# EAGLE design lora_mini_uno (EAGLE 8.2.2)

## Sheet 1 of 2
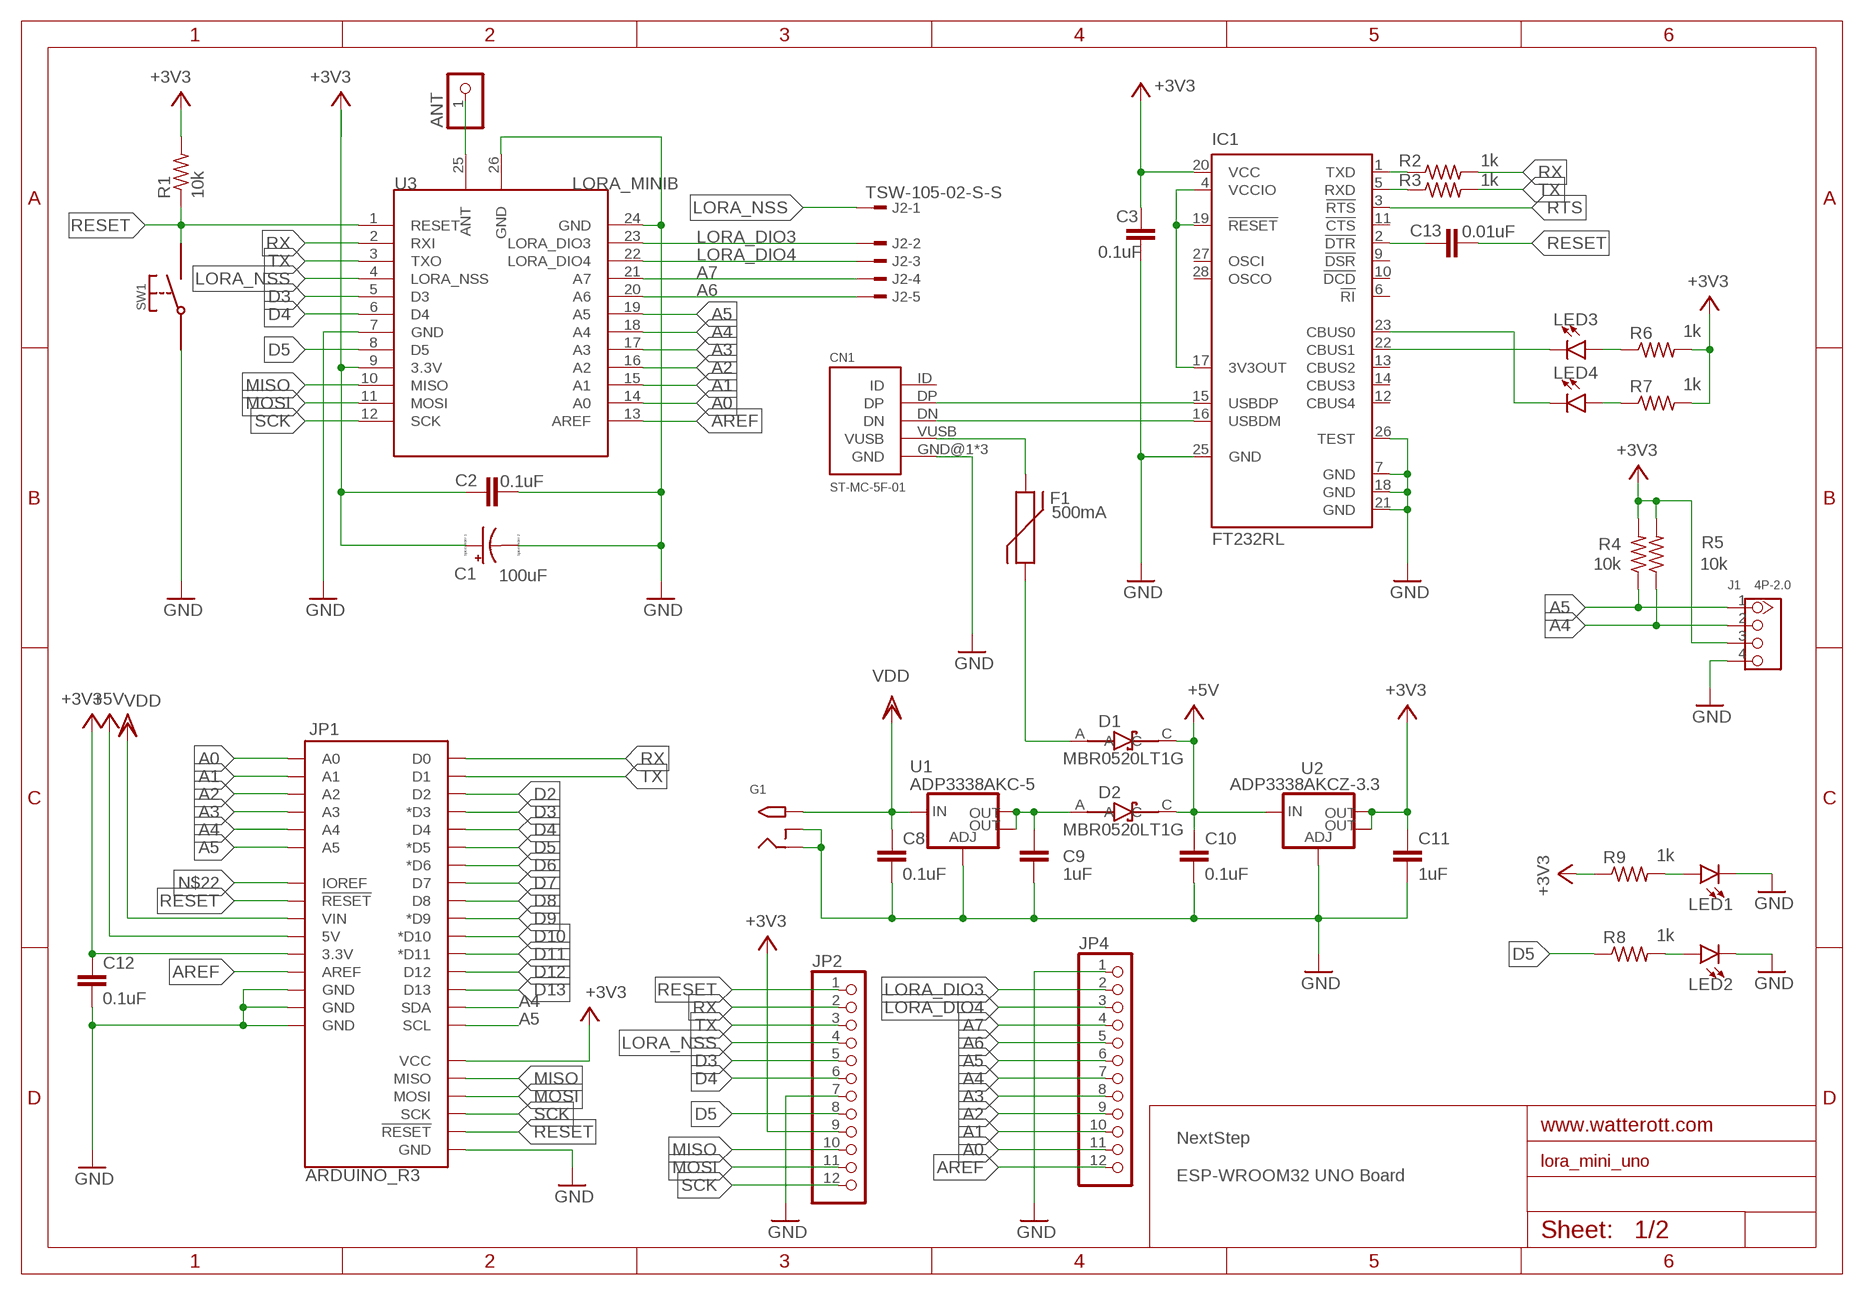
[diagram p0: schematic, sheet 1]

### Parts
ANT  PINHD-1X1  [1X01]
C1  100uF  CPOL-US153CLV-0505  [153CLV-0505]
C2  0.1uF  C-EUC0603K  [C0603K]
C3  0.1uF  C-EUC0603K  [C0603K]
C8  0.1uF  C-EUC0603K  [C0603K]
C9  1uF  C-EUC0603K  [C0603K]
C10  0.1uF  C-EUC0603K  [C0603K]
C11  1uF  C-EUC0603K  [C0603K]
C12  0.1uF  C-EUC0603K  [C0603K]
C13  0.01uF  C-EUC0603K  [C0603K]
CN1  ST-MC-5F-01  [ST-MC-5F-01]
D1  MBR0520LT1G  [SOD3716X135N]
D2  MBR0520LT1G  [SOD3716X135N]
F1  500mA  FUSE1206  [R1206]
G1  2.1MMJACKTHM  [PJ-102A]
IC1  FT232RL  [SSOP28]
J1  4P-2.0  GROVE-CONNECTOR-DIP(4P-2.0)  [HW4-2.0]
J2  TSW-105-02-S-S  [TSW-105-02-S-S]
JP1  ARDUINO_R3  [ARDUINO_R3]
JP2  PINHD-1X12-CB  [1X12-CB]
JP4  PINHD-1X12-CB  [1X12-CB]
LED1  LED0603  [LED-0603]
LED2  LED0603  [LED-0603]
LED3  LED0603  [LED-0603]
LED4  LED0603  [LED-0603]
R1  10k  R-US_R0603  [R0603]
R2  1k  R-US_R0603  [R0603]
R3  1k  R-US_R0603  [R0603]
R4  10k  R-US_R0603  [R0603]
R5  10k  R-US_R0603  [R0603]
R6  1k  R-US_R0603  [R0603]
R7  1k  R-US_R0603  [R0603]
R8  1k  R-US_R0603  [R0603]
R9  1k  R-US_R0603  [R0603]
SW1  RESET  SWITCH  [SWITCH_3X6X5MM]
U1  ADP3338AKC-5  V_REG_LM1117SOT223  [SOT223]
U2  ADP3338AKCZ-3.3  V_REG_LM1117SOT223  [SOT223]
U3  LORA_MINIB  [LORA_MINI_PCB]

### Nets
+3V3 [Power]: C1.+ C2.1 C3.1 C11.1 C12.1 IC1.20(VCC) J1.3 JP1.3.3V JP1.VCC JP2.9 R1.2 R4.2 R5.2 R6.2 R7.2 R9.1 U2.2(OUT) U2.4(OUT) U3.9(3.3V) ; also sheet 2
+5V [Power]: C10.1 D1.C D2.C JP1.5V U2.3(IN)
A0: JP1.A0 JP4.11 U3.14(A0)
A1: JP1.A1 JP4.10 U3.15(A1)
A2: JP1.A2 JP4.9 U3.16(A2)
A3: JP1.A3 JP4.8 U3.17(A3)
A4: J1.2 JP1.A4 JP1.SDA JP4.7 R5.1 U3.18(A4) ; also sheet 2
A5: J1.1 JP1.A5 JP1.SCL JP4.6 R4.1 U3.19(A5) ; also sheet 2
A6: J2.5 JP4.5 U3.20(A6)
A7: J2.4 JP4.4 U3.21(A7)
AREF: JP1.AREF JP4.12 U3.13(AREF)
D2: JP1.D2
D3: JP1.D3(*D3) JP2.5 U3.5(D3)
D4: JP1.D4 JP2.6 U3.6(D4)
D5: JP1.D5(*D5) JP2.8 R8.1 U3.8(D5)
D6: JP1.D6(*D6)
D7: JP1.D7
D8: JP1.D8
D9: JP1.D9(*D9)
D10: JP1.D10(*D10)
D11: JP1.D11(*D11)
D12: JP1.D12
D13: JP1.D13
D+: CN1.DP IC1.15(USBDP)
D-: CN1.DN IC1.16(USBDM)
GND [GND]: C1.- C2.2 C3.2 C8.2 C9.2 C10.2 C11.2 C12.2 CN1.GND@1(GND) CN1.GND@2(GND) CN1.GND@3(GND) G1.RING G1.RING_SW IC1.7(GND) IC1.18(GND) IC1.21(GND) IC1.25(GND) IC1.26(TEST) J1.4 JP1.GND@1(GND) JP1.GND@2(GND) JP1.GND@3(GND) JP1.GND@4(GND) JP2.7 JP4.1 LED1.C LED2.C SW1.P$1 U1.1(ADJ) U2.1(ADJ) U3.7(GND) U3.24(GND) U3.26(GND) ; also sheet 2
LORA_DIO3: J2.2 JP4.2 U3.23(LORA_DIO3)
LORA_DIO4: J2.3 JP4.3 U3.22(LORA_DIO4)
LORA_NSS: J2.1 JP2.4 U3.4(LORA_NSS)
MISO: JP1.MISO JP2.10 U3.10(MISO)
MOSI: JP1.MOSI JP2.11 U3.11(MOSI)
N$2: IC1.22(CBUS1) LED3.C
N$3: IC1.23(CBUS0) LED4.C
N$5 [Power]: CN1.VUSB F1.2
N$6: IC1.1(TXD) R2.1
N$7: IC1.4(VCCIO) IC1.17(3V3OUT) IC1.19(!RESET)
N$9: C13.1 IC1.2(!DTR)
N$10: IC1.5(RXD) R3.1
N$11: ANT.1 U3.25(ANT)
N$12: LED2.A R8.2
N$13 [Power]: C9.1 D2.A U1.2(OUT) U1.4(OUT)
N$14 [Power]: D1.A F1.1
N$22: JP1.IOREF
PWR-LED: LED1.A R9.2
RESET: C13.2 JP1.RESET@1(!RESET!) JP1.RESET@2(!RESET!) JP2.1 R1.1 SW1.P$2 U3.1(RESET)
RTS: IC1.3(!RTS)
RX: JP1.D0 JP2.2 R2.2 U3.2(RXI)
RX-LED: LED3.A R6.1
SCK: JP1.SCK JP2.12 U3.12(SCK)
TX: JP1.D1 JP2.3 R3.2 U3.3(TXO)
TX-LED: LED4.A R7.1
VDD [Power]: C8.1 G1.TIP JP1.VIN U1.3(IN)
Unconnected: CN1.ID IC1.6(!RI) IC1.9(!DSR) IC1.10(!DCD) IC1.11(!CTS) IC1.12(CBUS4) IC1.13(CBUS2) IC1.14(CBUS3) IC1.27(OSCI) IC1.28(OSCO)

### Notes on the sheet
- NextStep
  
  ESP-WROOM32 UNO Board

## Sheet 2 of 2
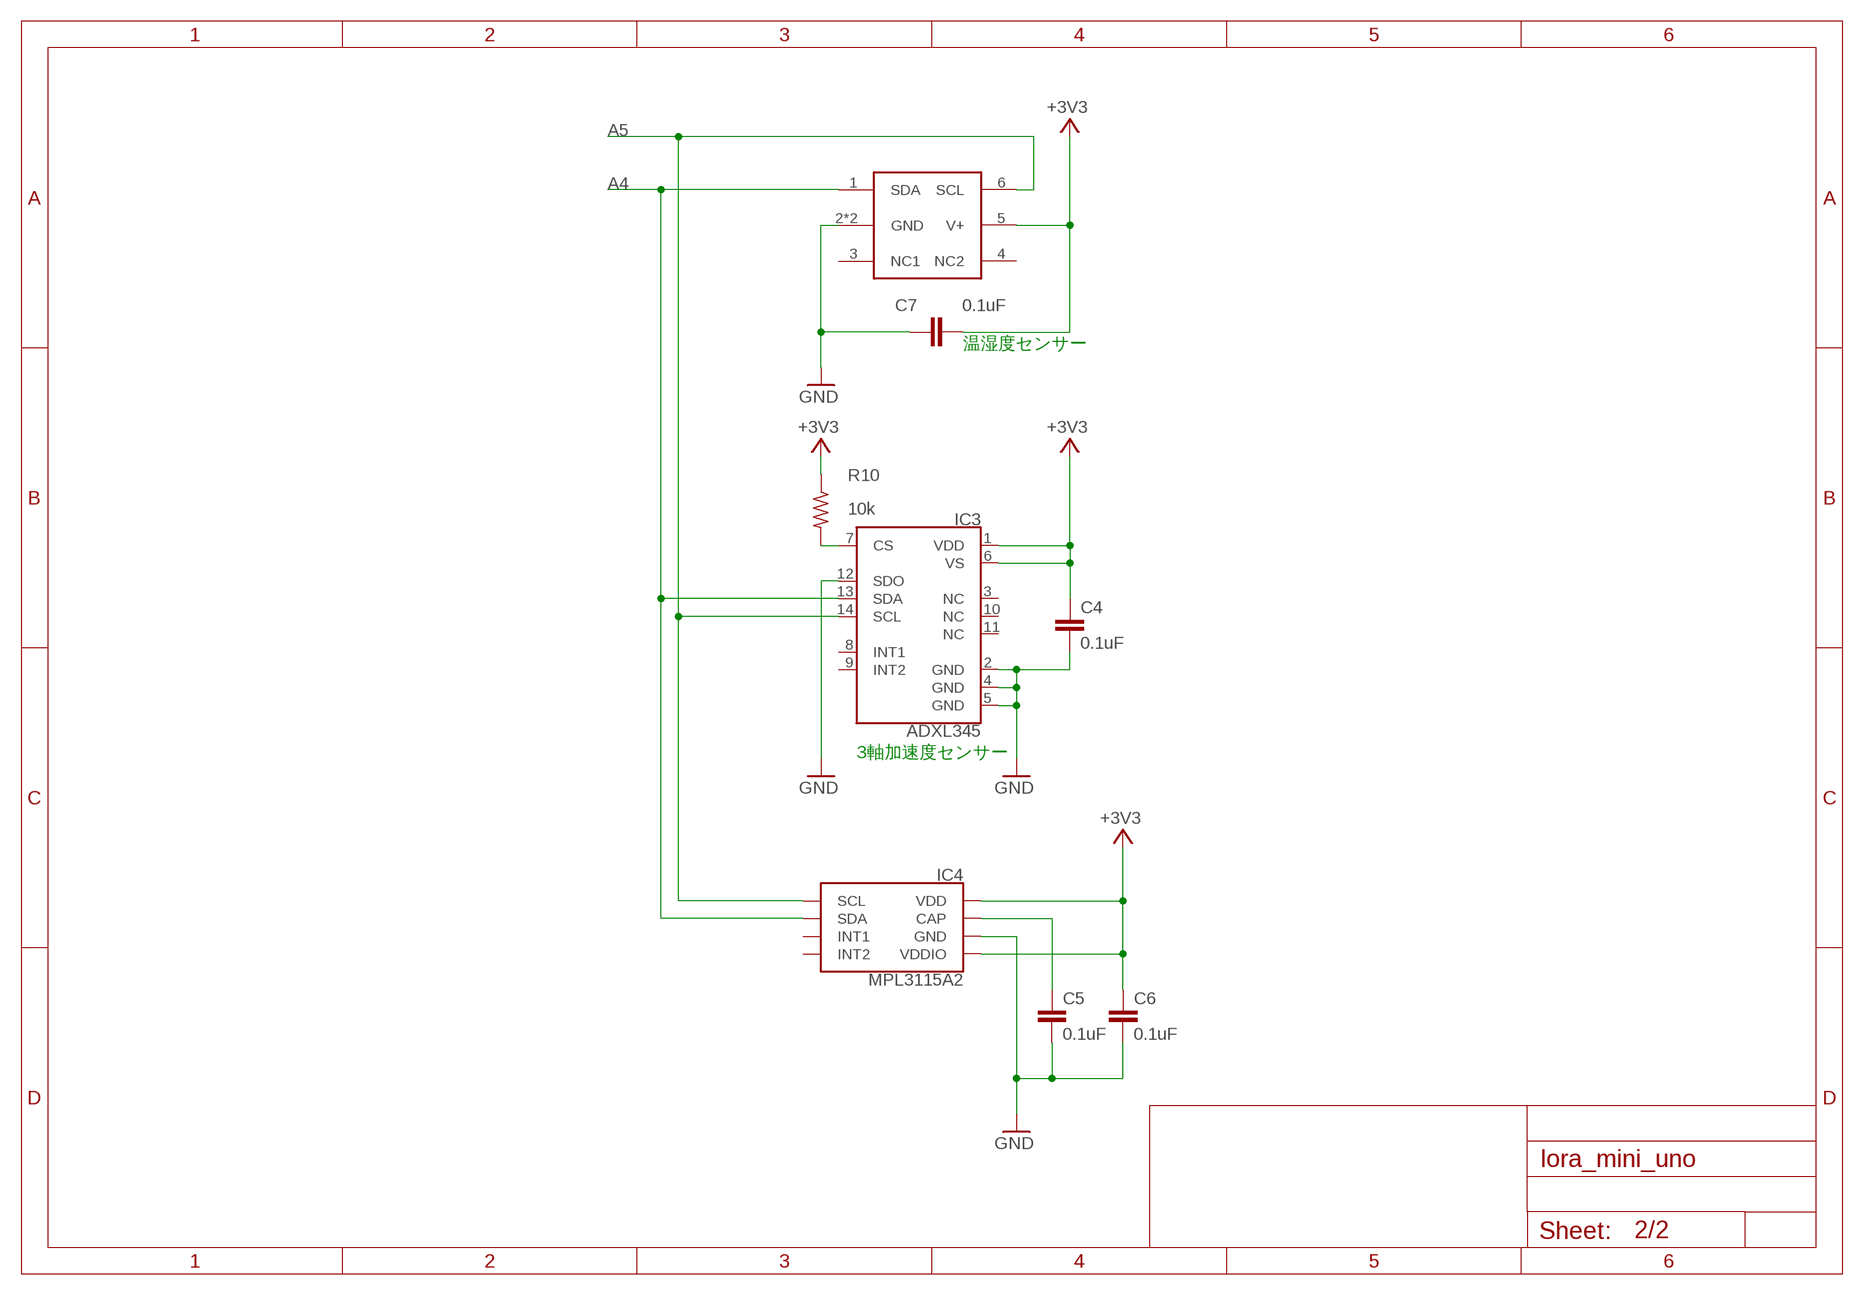
[diagram p1: schematic, sheet 2]

### Parts
C4  0.1uF  C-EUC0603K  [C0603K]
C5  0.1uF  C-EUC0603K  [C0603K]
C6  0.1uF  C-EUC0603K  [C0603K]
C7  0.1uF  C-EUC0603K  [C0603K]
IC2  SHT21  [SHT21]
IC3  ADXL345  [LGA-14]
IC4  MPL3115A2  [LGA-8-5X3]
R10  10k  R-US_R0603  [R0603]

### Nets
+3V3 [Power]: C4.1 C6.1 C7.2 IC2.5(V+) IC3.1(VDD) IC3.6(VS) IC4.1(VDD) IC4.4(VDDIO) R10.1 ; also sheet 1
A4: IC2.1(SDA) IC3.13(SDA) IC4.7(SDA) ; also sheet 1
A5: IC2.6(SCL) IC3.14(SCL) IC4.8(SCL) ; also sheet 1
GND [GND]: C4.2 C5.2 C6.2 C7.1 IC2.2(GND) IC2.P$1(GND) IC3.2(GND) IC3.4(GND) IC3.5(GND) IC3.12(SDO) IC4.3(GND) ; also sheet 1
N$1: IC3.7(CS) R10.2
N$15: C5.1 IC4.2(CAP)
Unconnected: IC2.3(NC1) IC2.4(NC2) IC3.3(NC) IC3.8(INT1) IC3.9(INT2) IC3.10(NC) IC3.11(NC) IC4.5(INT2) IC4.6(INT1)

### Notes on the sheet
- 温湿度センサー
- 3軸加速度センサー

## Library data of the parts
ANT = adafruit:PINHD-1X1: Pin header 1x1 for 0.1" spacing With round pins
C1 = resistor:CPOL-US: POLARIZED CAPACITOR, American symbol
C2-C13 = resistor:C-EU: CAPACITOR, European symbol
CN1 = st-mc-5f-01:ST-MC-5F-01
D1 D2 = MBR0520LT1G:MBR0520LT1G: Rectifier, Schottky Power; Plastic Sod-123; 0.5 a @ +90c If; +125; 20v; 1000; AVAILABILITY: Good; DESCRIPTION: Rectifier, Schottky Power; Plastic Sod-123; 0.5 a @ +90c If; +125; 20v; 1000; MF: ON Semiconductor; MP: MBR0520LT1G; PACKAGE: SOD-123 ON Semiconductor; PRICE: 0.14 USD
F1 = dragino:FUSE: FUSE 5 x 20 mm
G1 = adafruit:2.1MMJACK: 2.1mm x 5.5mm THM DC jack with internal switch. Digikey part #PJ-102A, 4UCON part #05537 2.1mm x 5.5mm SMT DC jack with internal switch. Digikey part #PJ-002A-SMT, 4UCON part #03267 By microbuilder.eu & adafruit.com
IC1 = ftdichip:FT232R: Source: http://www.ftdichip.com/Documents/DataSheets/DS_FT232R_v104.pdf; MPN: FT232RL; OC_FARNELL: 1146032; OC_NEWARK: 91K9918
IC2 = SHT21:SHT21: Tempsensor RS No: 709-8868 MRF No: TMP112AIDRLT
IC3 = SparkFun-Sensors:ADXL345: Analog Devices ADXL345 3-Axis SPI/I2C 2/4/8/16g Accelerometer The ADXL345 is a small, thin, low power, 3-axis accelerometer with high resolution (13-bit) measurement at up to ±16g. Digital output data is formatted as 16-bit twos complement and is accessible through either a SPI (3- or 4-wire) or I2C digital interface. Datasheet <https://www.sparkfun.com/datasheets/Sensors/Accelerometer/ADXL345.pdf> SparkFun Products SparkFun Triple Axis Accelerometer Breakout - ADXL345 <https://www.sparkfun.com/products/9836> (SEN-09836) Triple Axis Accelerometer - ADXL345 <https://www.sparkfun.com/products/9045> (SEN-09045) SparkFun 6 Degrees of Freedom IMU Digital Combo Board - ITG3200/ADXL345 <https://www.sparkfun.com/products/10121> (SEN-10121); PROD_ID: IC-09097; SF_ID: SEN-09045
IC4 = SparkFun-Sensors:MPL3115A2: NXP MPL3115A2 Digital Altimeter/Pressure Sensor The MPL3115A2 is a compact piezoresistive absolute pressure sensor with an I2C interface. MPL3115 has a wide operating range of 20kPa to 110 kPa, a range that covers all surface elevations on Earth. The fully internally compensated MEMS in conjunction with an embedded high resolution 24-bit equivalent ADC provide accurate pressure [Pascals] /altitude [meters] and temperature [degrees Celsius] data. Datasheet <http://cdn.sparkfun.com/datasheets/Sensors/Pressure/MPL3115A2.pdf> SparkFun Products SparkFun Altitude/Pressure Sensor Breakout - MPL3115A2 <https://www.sparkfun.com/products/11084> (SEN-11084) SparkFun Weather Shield <https://www.sparkfun.com/products/12081> (DEV-12081) SparkFun Photon Weather Shield <https://www.sparkfun.com/products/13630> (DEV-13630); PROD_ID: IC-10869
J1 = Seeed-OPL-Connector:GROVE-CONNECTOR-DIP(4P-2.0): 320110033
J2 = con-samtec:TSW-105-02-S-S: THROUGH-HOLE .025" SQ POST HEADER Source: Samtec TSW.pdf; OC_FARNELL: unknown; OC_NEWARK: unknown
JP1 = SparkFun-Boards:ARDUINO_R3: Arduino R3 Footprint (w/ SPI header)
JP2 JP4 = adafruit:PINHD-1X12: PIN HEADER
LED1-LED4 = SparkFun-LED:LED: LED (Generic) Standard schematic elements and footprints for 5mm, 3mm, 1206, and 0603 sized LEDs. Generic LEDs with no color specified.
R1-R10 = resistor:R-US_: RESISTOR, American symbol
SW1 = dragino:SWITCH
U1 U2 = SparkFun-PowerIC:V_REG_LM1117: Voltage Regulator LM1117 Standard adjustable voltage regulator but in SMD form. Spark Fun Electronics SKU : COM-00595; PROD_ID: VREG-08170
U3 = dragino:LORA_MINI

## Net classes
0 default: width 0.229 mm
1 Power: width 0.508 mm, clearance 0.152 mm
2 GND: width 0.203 mm

## Board
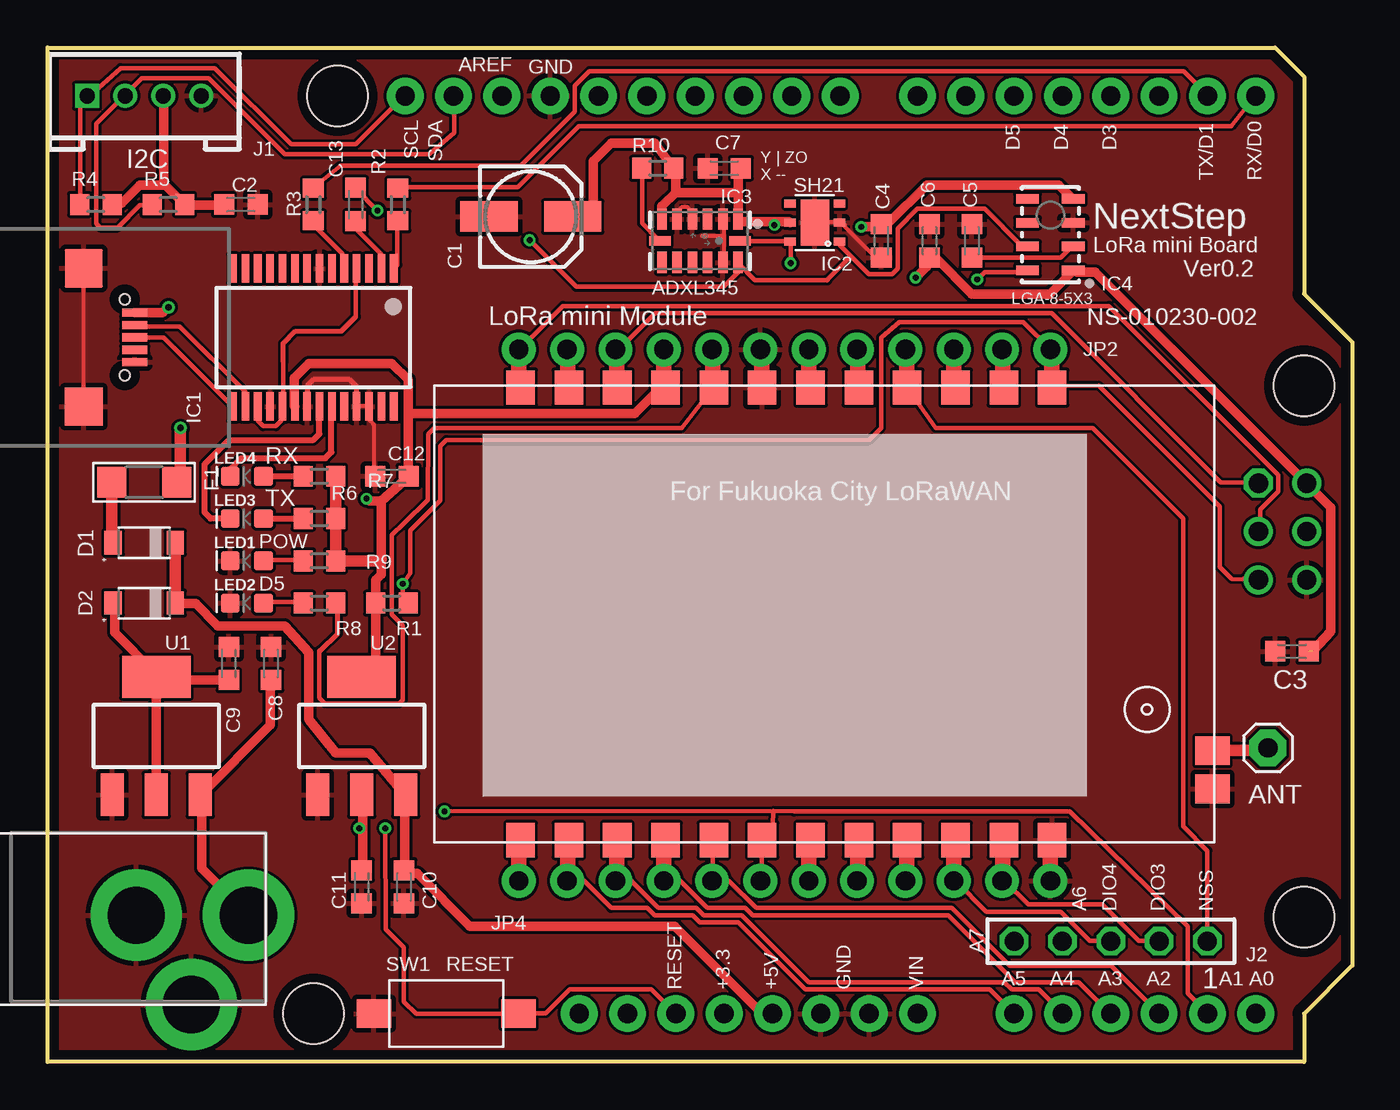
[diagram p2: board, top side]
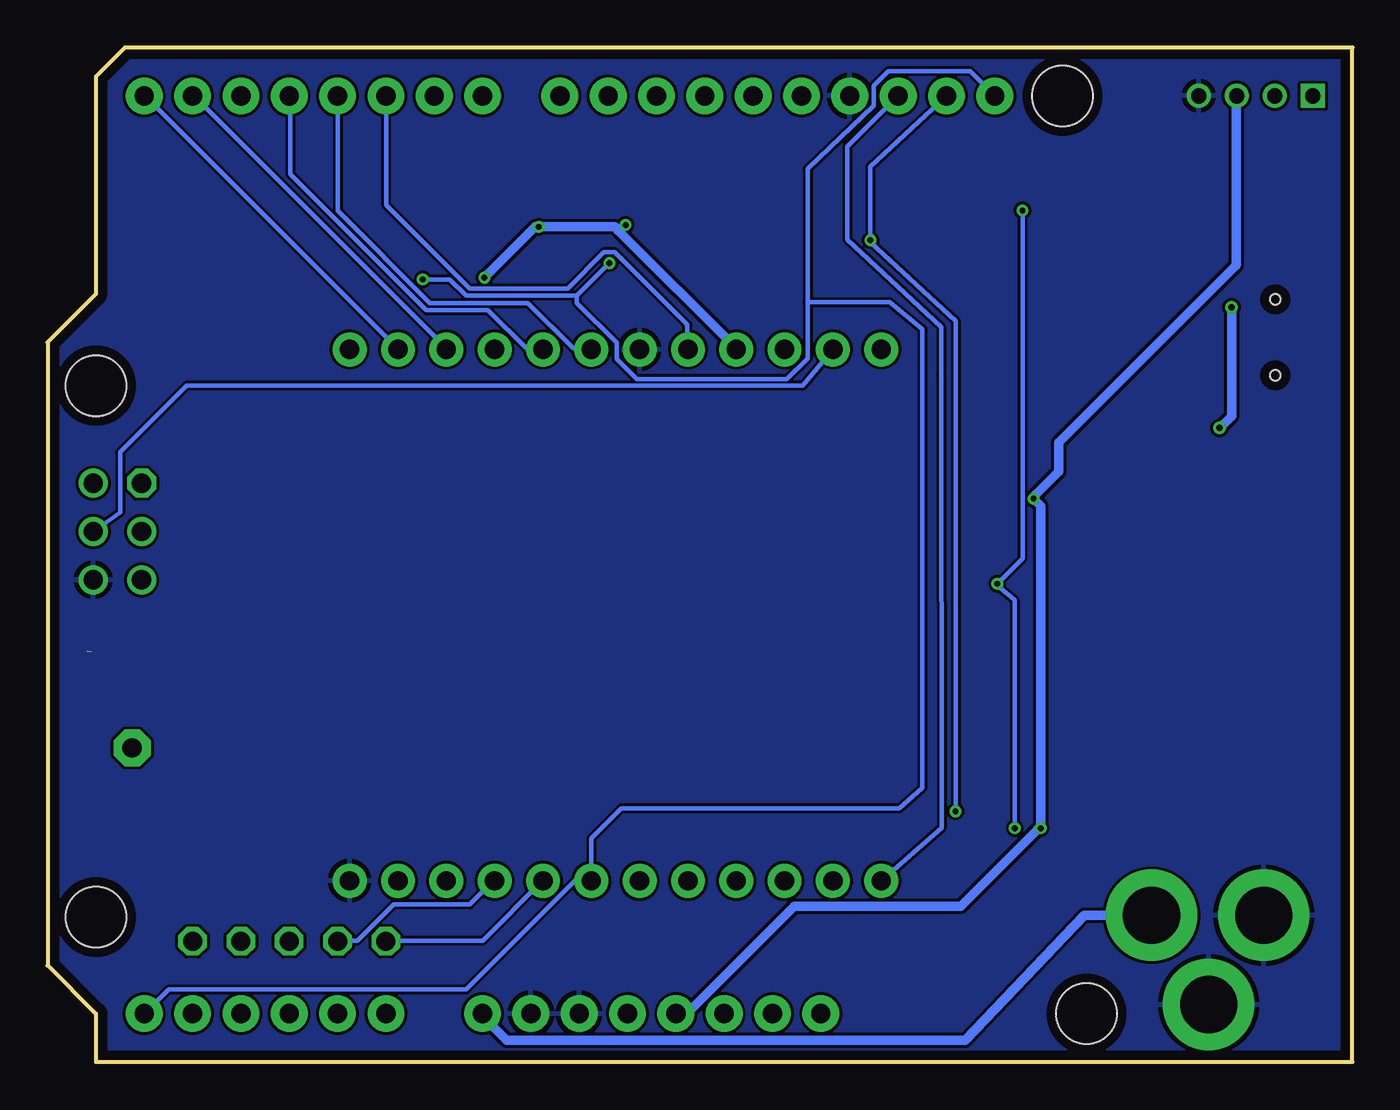
[diagram p3: board, bottom side, seen from below]

Size 68.58 x 53.34 mm. Coordinates in mm from the lower left corner, seen from the top.
Copper layers (1*16): Top 0.035mm / dielectric 1.6mm / Bottom 0.035mm
Design rules "Elecrow_2-layer_PCB_eagle_rule": minimum track width 6mil, minimum drill 12mil, track to track 6mil, track to pad 6mil, pad to pad 6mil, via to via 8mil, smd to smd 0mil, copper to edge 20mil, drill to drill 10mil, minimum pad ring 6mil, minimum via ring 6mil, stop-mask expansion 0mil, vias tented up to drill 100mil, thermal gap 10mil
vRestrict: area 2.2,13 to 9.2,21.6; area 13.3,12.7 to 19.7,21.6; area 31.1,41.3 to 37.5,45.1; area 50.5,40 to 54.9,46.7

### Footprints (pad centres in the part's own frame; a part is rotated, then mirrored left to right if it is on the bottom)
1X01 = drill 1.016 pad 1.93 octagon: 1 0,0
153CLV-0505 = smd 3 x 1.6: + 2.2,0; - -2.2,0
C0603K = smd 1.05 x 1.08: 1 -0.875,0; 2 0.875,0
ST-MC-5F-01 = smd 0.4 x 1.35: DN -0.65,2.675; DP 0,2.675; GND@3 1.3,2.675; ID 0.65,2.675; VUSB -1.3,2.675 | smd 2 x 2: GND@1 -3.63,0; GND@2 3.63,0 | hole 0.55: -2,2.15; 2,2.15
SOD3716X135N = smd 0.91 x 1.22: A 1.635,0; C -1.635,0
R1206 = smd 1.52 x 1.6: 1 -1.71,0; 2 1.71,0
PJ-102A = drill 3 pad 4.8: RING 0.1,-3.39; RING_SW -4.6,-6.29; TIP 0.1,-9.29
SSOP28 = smd 0.4 x 1.5: 1 -4.225,-3.625; 2 -3.575,-3.625; 3 -2.925,-3.625; 4 -2.275,-3.625; 5 -1.625,-3.625; 6 -0.975,-3.625; 7 -0.325,-3.625; 8 0.325,-3.625; 9 0.975,-3.625; 10 1.625,-3.625; 11 2.275,-3.625; 12 2.925,-3.625; 13 3.575,-3.625; 14 4.225,-3.625; 15 4.225,3.625; 16 3.575,3.625; 17 2.925,3.625; 18 2.275,3.625; 19 1.625,3.625; 20 0.975,3.625; 21 0.325,3.625; 22 -0.325,3.625; 23 -0.975,3.625; 24 -1.625,3.625; 25 -2.275,3.625; 26 -2.925,3.625; 27 -3.575,3.625; 28 -4.225,3.625
SHT21 = smd 0.4 x 0.6: 1 -1,-1.3; 2 0,-1.3; 3 1,-1.3; 4 1,1.3; 5 0,1.3; 6 -1,1.3 | smd 2.4 x 1.5: P$1 0,0
LGA-14 = smd 0.5 x 1.124: 1 2,1.138; 2 1.2,1.138; 3 0.4,1.138; 4 -0.4,1.138; 5 -1.2,1.138; 6 -2,1.138; 8 -2,-1.13; 9 -1.2,-1.138; 10 -0.4,-1.138; 11 0.4,-1.138; 12 1.2,-1.138; 13 2,-1.138 | smd 1.124 x 0.5: 7 -2.1,0; 14 2.1,0
LGA-8-5X3 = smd 1.2 x 0.5: 1 -1.2,1.875; 2 -1.2,0.625; 3 -1.2,-0.625; 4 -1.2,-1.875; 5 1.2,-1.875; 6 1.2,-0.625; 7 1.2,0.625; 8 1.2,1.875
HW4-2.0 = drill 0.8 pad 1.27 square: 1 -3,0 | drill 0.8 pad 1.27: 2 -1,0; 3 1,0; 4 3,0
TSW-105-02-S-S = drill 1 pad 1.5 octagon: 1 5.08,0; 2 2.54,0; 3 0,0; 4 -2.54,0; 5 -5.08,0
ARDUINO_R3 = drill 1.016 pad 1.93: 3.3V 35.56,2.54; 5V 38.1,2.54; A0 50.8,2.54; A1 53.34,2.54; A2 55.88,2.54; A3 58.42,2.54; A4 60.96,2.54; A5 63.5,2.54; AREF 23.876,50.8; D0 63.5,50.8; D1 60.96,50.8; D2 58.42,50.8; D3 55.88,50.8; D4 53.34,50.8; D5 50.8,50.8; D6 48.26,50.8; D7 45.72,50.8; D8 41.656,50.8; D9 39.116,50.8; D10 36.576,50.8; D11 34.036,50.8; D12 31.496,50.8; D13 28.956,50.8; GND@1 40.64,2.54; GND@2 43.18,2.54; GND@3 26.416,50.8; IOREF 30.48,2.54; NC 27.94,2.54; RESET@1 33.02,2.54; SCL 18.796,50.8; SDA 21.336,50.8; VIN 45.72,2.54 | drill 1.016: GND@4 66.18,25.35; MOSI 66.18,27.89; RESET@2 63.64,25.35; SCK 63.64,27.89; VCC 66.18,30.43 | drill 1.016 octagon: MISO 63.64,30.43 | hole 3.175: 15.24,50.8; 66.04,35.56; 66.04,7.62; 13.97,2.54
1X12-CB = drill 1.016 pad 1.778: 1 -13.97,0; 2 -11.43,0; 3 -8.89,0; 4 -6.35,0; 5 -3.81,0; 6 -1.27,0; 7 1.27,0; 8 3.81,0; 9 6.35,0; 10 8.89,0; 11 11.43,0; 12 13.97,0
LED-0603 = smd 1 x 1: A -0.877,0; C 0.877,0
R0603 = smd 1 x 1.1: 1 -0.85,0; 2 0.85,0
SWITCH_3X6X5MM = smd 1.8 x 1.5: P$1 -3.8,0; P$2 3.8,0
SOT223 = smd 1.219 x 2.235: 1 -2.311,-3.099; 2 0,-3.099; 3 2.311,-3.099 | smd 3.6 x 2.2: 4 0,3.099
LORA_MINI_PCB = smd 1.8 x 1.5: 1 0.1,32.48; 2 0.1,29.94; 3 0.1,27.4; 4 0.1,24.86; 5 0.1,22.32; 6 0.1,19.78; 7 0.1,17.24; 8 0.1,14.7; 9 0.1,12.16; 10 0.1,9.62; 11 0.1,7.08; 12 0.1,4.54; 13 23.9,4.54; 14 23.9,7.08; 15 23.9,9.62; 16 23.9,12.16; 17 23.9,14.7; 18 23.9,17.24; 19 23.9,19.78; 20 23.9,22.32; 21 23.9,24.86; 22 23.9,27.4; 23 23.9,29.94; 24 23.9,32.48 | smd 1.5 x 1.8: 25 19.2,40.9; 26 21.2,40.9

### Placement (x,y rotation side)
ANT  64.14,16.51 0 top
C1  25.4,44.45 0 top
C2  10.16,45.09 0 top
C3  65.41,21.59 180 top
C4  43.81,43.18 270 top
C5  48.58,43.18 90 top
C6  46.35,43.18 90 top
C7  35.56,46.99 0 top
C8  11.75,20.95 90 top
C9  9.53,20.95 90 top
C10  18.73,9.21 270 top
C11  16.51,9.21 270 top
C12  18.1,30.8 180 top
C13  16.19,45.09 90 top
CN1  1.91,38.1 270 top
D1  5.08,27.3 180 top
D2  5.08,24.13 180 top
F1  5.08,30.48 0 top
G1  1.27,7.62 90 top
IC1  13.97,38.1 180 top
IC2  40.32,44.13 90 top
IC3  34.29,43.18 0 top
IC4  52.7,43.5 180 top
J1  5.08,50.8 0 top
J2  55.88,6.35 0 top
JP1  0,0 0 top
JP2  38.73,37.47 180 top
JP4  38.73,9.53 180 top
LED1  10.48,26.35 180 top
LED2  10.48,24.13 180 top
LED3  10.48,28.57 180 top
LED4  10.48,30.8 180 top
R1  18.1,24.13 180 top
R2  18.41,45.09 90 top
R3  13.97,45.09 90 top
R4  2.54,45.09 0 top
R5  6.35,45.09 0 top
R6  14.29,28.57 0 top
R7  14.29,30.8 0 top
R8  14.29,24.13 180 top
R9  14.29,26.35 180 top
R10  32.07,46.99 180 top
SW1  20.95,2.54 0 top
U1  5.71,17.14 0 top
U2  16.51,17.14 0 top
U3  20.32,35.56 270 top

### Tracks (layer width: path | path; a pad name or v marks a point on that pad's centre or on a via)
+3V3  (via drill 0.3)  (1 unrouted)
  Top 0.203: 28.67,44.45 C1.+
  Top 0.508: 66.48,21.62 67.44,22.64 67.44,29.15 66.2,30.39 JP1.VCC 66.01,30.57 55.05,41.53 54.1,41.53 IC4.1 53.82,41.53 52.67,40.39 48.58,40.39 46.67,42.29 46.39,42.29 C6.1 46.2,42.1 46.2,41.81 v45.62,41.24 | 38.2,44.2 36.39,44.2 36.29,44.29 IC3.1 36.29,45.55 | 38.2,44.2 38.96,44.2 IC2.5 | 28.67,44.45 28.67,47.37 29.62,48.32 31.91,48.32 32.77,47.15 | 32.77,47.15 R10.1 | C2.1 9.24,45.05 7.24,45.05 R5.2 7.05,45.24 6.19,46.1 6.1,46.1 | 6.1,46.1 4.86,46.1 3.9,45.15 3.43,45.15 R4.2 | 6.1,46.1 6.1,50.77 J1.3 | IC4.4 53.82,45.43 53.15,46.1 46.2,46.1 44.2,44.1 43.81,44.1 C4.1 43.62,43.91 v42.77,43.91 | U2.4 16.57,20.29 17.24,20.95 17.24,24.1 R1.2 17.24,24.38 17.24,25.34 17.53,25.62 17.53,26.44 17.53,29.5 | 32.38,35.53 U3.9 32.19,35.43 30.86,34.1 18.95,34.1 | 16.57,12.29 16.57,14 U2.2 | 16.57,12.29 16.57,10.1 C11.1 | 17.53,29.5 18.95,30.77 C12.1 18.95,31.05 18.95,34.1 | 17.53,29.5 16.92,29.5 v16.76,29.62 | 18.95,34.1 18.95,35.88 18.1,36.73 13.72,36.73 12.95,35.97 12.95,34.48 IC1.20 | v16.38,12.29 16.57,12.29 | v38.2,44.01 38.2,44.2 | IC3.6 32.29,44.99 33.02,45.72 | 33.02,45.72 33.02,46.9 32.77,47.15 | 36.29,45.55 36.29,46.84 C7.2 | 33.02,45.72 36.12,45.72 36.29,45.55
  Top 0.61: R7.2 R6.2 15.26,28.57 15.14,28.46 R9.1 17.44,26.35 17.53,26.44
  Top 0.813: JP2.9 32.38,35.53
  Bottom 0.508: JP1.3.3V 35.53,2.57 34.96,2.57 29.34,8.19 20.57,8.19 16.57,12.19 v16.38,12.29 16.38,29.24 v16.76,29.62 16.67,29.81 15.43,31.05 15.43,32.58 6.1,41.91 6.1,50.77 J1.3 | 38.53,43.67 32.38,37.53 JP2.9 | 38.53,43.67 38.77,43.91 v42.77,43.91 42.96,43.91 v45.62,41.24 | 38.53,43.67 v38.2,44.01
+5V
  Top 0.508: 6.76,24.1 7.78,24.1 8.95,22.92 12.48,22.92 13.72,21.53 13.72,18 15.14,16.26 16.92,16.26 18.67,14.19 U2.3 18.76,14 18.76,10.1 C10.1 18.95,9.91 19.43,9.91 22.19,7.14 32.96,7.14 37.53,2.57 38.1,2.57 JP1.5V | 6.76,24.1 D2.C | 6.76,27.53 6.76,27.34 D1.C | 6.71,24.21 arc45 6.76,24.1
  Top 0.61: D1.C 6.71,24.21
A0
  Top 0.229: 27.34,11.62 U3.14 | 27.34,9.53 JP4.11 28.19,9.53 29.62,8.1 31.53,8.1 31.91,7.71 33.91,7.71 34.29,7.33 36.29,7.33 39.81,3.81 49.53,3.81 JP1.A0
  Top 0.813: 27.34,9.53 27.34,11.62
A1
  Top 0.229: 29.91,11.62 U3.15 | 29.91,9.53 JP4.10 30.67,9.53 32.1,8.1 34.1,8.1 34.48,7.71 36.48,7.71 40.01,4.19 50.29,4.19 50.67,3.81 52.1,3.81 53.34,2.57 JP1.A1
  Top 0.813: 29.91,9.53 29.91,11.62
A2
  Top 0.229: 32.38,11.62 U3.16 | JP4.9 33.24,9.53 34.67,8.1 36.67,8.1 37.05,7.71 47.34,7.71 50.86,4.19 54.2,4.19 55.82,2.57 JP1.A2
  Top 0.813: JP4.9 32.38,11.62
A3
  Top 0.229: U3.17 34.96,11.62 34.96,9.53 JP4.8 35.81,9.53 37.24,8.1 47.53,8.1 50.58,5.05 55.91,5.05 JP1.A3
A4  (via drill 0.3)
  Top 0.229: JP4.7 37.53,9.53 37.53,11.62 U3.18 37.62,11.72 38.1,11.72 38.15,13.19 | 38.15,13.19 39.24,13.18 53.72,13.18 59.91,7.14 59.91,3.62 60.96,2.57 JP1.A4 | 40.96,41.12 37.18,41.12 36.29,42.01 IC3.13 36.48,41.72 35.53,40.77 27.78,40.77 v25.34,43.21 | 41.53,43.05 IC2.1 41.62,42.96 42.22,42.36 | 42.22,42.36 43.15,41.43 44.39,41.43 44.67,41.72 44.67,43.81 45.72,44.86 49.24,44.86 51.15,42.96 51.44,42.96 IC4.7 | R5.1 5.43,45.05 4.86,45.05 3.68,43.88 2.76,43.88 2.57,44.07 2.57,49.34 4,50.77 J1.2 4.1,50.86 4.95,51.72 8.48,51.72 12.48,47.72 20.07,47.72 21.37,48.86 21.34,50.77 JP1.SDA | v20.86,13.18 38.15,13.19 | 40.99,41.13 42.22,42.36
  Top 0.254: 40.96,41.12 arc45 40.99,41.13
  Bottom 0.229: JP1.SDA 21.34,50.77 25.34,47.09 v25.34,43.21 25.34,43.12 20.86,38.96 v20.86,13.18
A5  (via drill 0.3)
  Top 0.229: 40.01,11.62 U3.19 | IC3.14 36.48,43.15 38.96,43.15 IC2.6 39.05,43.05 v39.05,42.01 | v48.86,41.15 49.24,41.53 51.44,41.53 IC4.8 | R4.1 1.71,45.15 1.71,50.48 2,50.77 J1.1 2.19,50.77 3.84,52.26 8.79,52.26 12.79,48.26 16.19,48.26 18.38,50.45 18.76,50.77 JP1.SCL
  Top 0.813: JP4.6 40.01,11.62
  Bottom 0.229: JP1.A5 63.44,2.57 62.2,3.81 46.58,3.81 40.86,9.53 JP4.6 40.01,11.75 38.42,13.34 23.81,13.34 22.61,14.41 22.61,38.54 24.32,39.94 28.64,39.94 | v48.86,41.15 47.43,41.15 46.58,40.29 40.77,40.29 | v39.05,42.01 40.77,40.29 | 40.77,40.29 40.77,39.91 38.67,37.81 38.67,36.96 37.62,35.91 29.72,35.91 28.64,36.99 28.64,39.94 | 28.64,39.94 28.64,46.96 25.15,50.29 25.15,51.34 24.38,52.1 20.1,52.1 JP1.SCL
A6
  Top 0.229: 42.58,11.62 U3.20 | 42.58,9.53 JP4.5
  Top 0.813: 42.58,9.53 42.58,11.62
  Bottom 0.229: J2.5 50.77,6.38 45.72,6.38 42.58,9.53 JP4.5
A7
  Top 0.229: 45.15,11.62 U3.21 | 45.15,9.53 JP4.4
  Top 0.813: 45.15,9.53 45.15,11.62
  Bottom 0.229: J2.4 53.34,6.38 52.29,6.38 50.39,8.29 46.39,8.29 45.15,9.53 JP4.4
AREF
  Top 0.229: 24.77,11.62 U3.13
  Top 0.813: JP4.12 24.77,11.62
  Bottom 0.229: JP4.12 21.59,12.32 21.62,36.1 21.62,38.64 26.54,43.24 26.54,48.13 JP1.AREF
D3
  Top 0.229: 42.58,35.53 U3.5 | 42.58,37.43 JP2.5
  Top 0.813: 42.58,37.43 42.58,35.53
  Bottom 0.229: JP2.5 42.58,37.53 43.43,37.53 45.43,39.53 48.67,39.53 55.82,46.67 55.82,50.77 JP1.D3
D4
  Top 0.229: 40.01,35.53 U3.6
  Top 0.813: JP2.6 40.01,35.53
  Bottom 0.229: JP1.D4 53.34,44.77 48.48,39.91 43.34,39.91 40.96,37.53 40.01,37.53 JP2.6
D5
  Top 0.229: 14.29,21.62 14.29,19.14 14.57,18.86 18.48,18.86 18.67,19.05 18.67,22.95 18.1,23.53 18.1,27.72 18.75,28.34 19.97,29.56 20,33.02 20.32,33.34 33.34,33.34 34.96,35.43 U3.8 34.96,35.53 | 34.96,37.43 JP2.8
  Top 0.254: 14.29,21.62 arc45 14.34,21.64 15.24,22.54 15.24,23.88 arc45 R8.1
  Top 0.813: 34.96,35.53 34.96,37.43
  Bottom 0.229: JP1.D5 50.77,50.77 50.77,45.05 46.39,40.67 41.24,40.67 39.34,42.58 38.77,42.58 34.96,38.77 34.96,37.53 JP2.8
D+
  Top 0.229: CN1.DP 6.1,38.1 9.72,34.48 IC1.15
D-
  Top 0.229: CN1.DN 4.67,38.67 6.95,38.67 10.38,35.24 IC1.16
GND
  Top 0.203: IC2.2 41.53,44.2 40.39,44.2 IC2.P$1 40.39,44.29 40.39,44.67 | C4.2 43.81,42.39 43.43,42.39 41.72,44.1 IC2.2 | 35.05,47.05 34.77,47.05 C7.1 | 41.91,44.01 IC2.2 | 37.53,35.53 U3.7 | 37.53,37.43 JP2.7 | IC3.5 33.15,44.39 33.15,44.77 33.34,44.96 33.62,44.96 33.81,44.77 33.81,44.39 IC3.4 33.91,44.29 33.91,43.91 | 35.53,43.43 35.53,44.29 IC3.2 | 35.53,43.43 35.53,42.1 IC3.12 | 35.53,43.43 34.38,43.43 | 46.39,44.1 C6.2 46.29,44.01 46.29,43.72 | 48.58,44.1 C5.2 | 11.05,45.05 C2.2 | 14.29,41.81 IC1.7 | 8.1,50.77 J1.4 | 10.95,45.15 C2.2 | 26.38,50.77 JP1.GND@3 | 66.1,25.34 JP1.GND@4 | 61.15,14.38 U3.26 | C12.2 17.14,30.86 17.14,33.53 16.95,33.72 16.95,34.38 IC1.26 16.86,34.48 16.29,34.48 IC1.25 | CN1.GND@2 CN1.GND@1 2,41.72 | 9.53,21.81 C9.2 | 11.72,21.81 C8.2 | 10.86,45.15 C2.2
  Top 0.254: IC1.25 16.25,35.51 15.88,35.88 13.97,35.88 13.65,35.56 IC1.21
  Top 0.813: 37.53,37.43 37.53,35.53 | JP4.1 52.7,11.43 arc-45 U3.24
  Bottom 0.203: 37.53,37.53 JP2.7 | 52.77,9.53 JP4.1 | 66.1,25.34 JP1.GND@4
  pour Top: 0,53.34 64.45,53.34 66.04,51.75 66.04,40.32 68.58,37.78 68.58,5.08 66.04,2.54 66.04,0 0.32,0 0,-0.32
  pour Bottom: 0,53.02 64.45,53.34 66.04,51.75 66.04,40.32 68.58,37.78 68.58,5.08 66.04,2.54 66.04,0 0.32,0 0,-0.64
LORA_DIO3
  Top 0.229: 50.2,11.62 U3.23 | 50.2,9.53 JP4.2 50.29,9.53 51.53,8.29 55.44,8.29 57.34,6.38 58.39,6.38 J2.2
  Top 0.813: 50.2,9.53 50.2,11.62
LORA_DIO4
  Top 0.229: 47.62,11.62 U3.22 | J2.3 55.82,6.38 54.77,6.38 53.24,7.91 49.34,7.91 47.72,9.53 JP4.3
  Top 0.813: JP4.3 47.62,11.62
LORA_NSS
  Top 0.229: U3.4 45.15,35.53 | 45.15,37.43 JP2.4 | 45.24,35.43 U3.4 | J2.1 60.96,11.11 59.69,12.38 59.69,28.57 54.93,33.34 46.67,33.34 U3.4
  Top 0.813: 45.15,37.43 45.15,35.53
MISO
  Top 0.229: 29.91,35.53 U3.10 | 29.91,37.43 JP2.10 30,37.43 31.94,39.37 52.77,39.37 61.66,30.48 63.63,30.48 JP1.MISO
  Top 0.813: 29.91,37.43 29.91,35.53
MOSI
  Top 0.229: 27.34,35.53 U3.11 | 27.34,37.43 JP2.11
  Top 0.813: 27.34,37.43 27.34,35.53
  Bottom 0.229: 66.1,27.91 JP1.MOSI 64.77,28.89 64.77,32.07 61.28,35.56 28.89,35.56 JP2.11
N$1
  Top 0.229: R10.2 31.24,46.96 31.24,44.1 32.1,43.24 IC3.7
N$2
  Top 0.305: LED3.C 8.57,28.57 8.26,28.89 8.26,31.43 9.53,32.7 13.97,32.7 14.29,33.02 14.29,34.47 IC1.22
N$3
  Top 0.305: LED4.C 9.6,31.19 10.16,31.75 14.61,31.75 14.92,32.07 14.92,34.45 IC1.23
N$5  (via drill 0.35)
  Top 0.508: CN1.VUSB 6.06,39.4 v6.35,39.69 | 6.99,30.68 F1.2
  Top 0.61: v6.99,33.34 6.99,30.68
  Bottom 0.508: v6.35,39.69 6.35,33.97 v6.99,33.34
N$6
  Top 0.229: R2.1 18.38,44.2 18.38,41.91 18.29,41.81 IC1.1
N$7
  Top 0.229: IC1.17 11.05,34.38 11.05,33.72 11.34,33.43 12,33.43 12.29,33.72 12.29,34.38 IC1.19 12.38,34.58 12.38,36.83 12.38,36.96 | 16.19,39.18 16.19,41.72 IC1.4
  Top 0.254: 12.38,36.83 12.38,37.78 13.02,38.42 15.43,38.42 16.19,39.18
N$9
  Top 0.229: C13.1 16.19,43.81 17.53,42.48 17.53,41.81 IC1.2
N$10
  Top 0.229: R3.1 14,44.2 14,44.01 15.53,42.48 15.53,41.81 IC1.5
N$11
  Top 0.229: ANT.1 64.01,16.38 | 61.25,16.38 U3.25
  Top 0.61: 64.01,16.38 61.25,16.38
N$12
  Top 0.229: LED2.A 11.43,24.19 13.43,24.19 R8.2
N$13
  Top 0.508: C9.1 9.53,20.1 5.81,20.1 5.71,20.19 U1.4 | D2.A 3.52,24.1 3.52,22.57 5.62,20.48 U1.4 | U1.4 U1.2
N$14
  Top 0.508: 3.37,27.38 D1.A
  Top 0.61: F1.1 3.37,27.38
N$15
  Top 0.229: C5.1 53.24,42.29 53.82,42.86 IC4.2
PWR-LED
  Top 0.229: LED1.A 11.43,26.38 13.43,26.38 R9.2
RESET  (via drill 0.3)
  Top 0.229: 62.87,25.43 63.63,25.43 JP1.RESET@2 62.23,25.4 61.59,26.04 61.59,29.21 55.24,35.56 52.77,35.53 U3.1 52.86,35.43 | SW1.P$2 24.77,2.57 26.19,2.57 27.43,3.81 31.72,3.81 32.96,2.57 JP1.RESET@1 | v17.34,44.77 16.19,45.91 C13.2 | R1.1 18.86,24.19 18.67,24.38 v18.67,25.15 19.05,25.72 19.05,27.94 20.64,29.53 20.64,32.38 20.95,32.7 43.18,32.7 43.81,33.34 43.81,38.1 44.77,38.89 51.28,38.89 52.77,37.43 JP2.1 52.67,37.53 | 24.77,2.67 SW1.P$2 | SW1.P$2 19.37,2.54 18.73,3.17 18.73,6.03 17.78,6.99 v17.75,12.29
  Top 0.813: 52.77,35.53 52.77,37.43
  Bottom 0.229: v17.34,44.77 17.34,26.48 v18.67,25.15 18.67,25.05 17.75,24.29 v17.75,12.29
RX
  Top 0.229: 50.2,35.53 U3.2 | 50.2,37.43 JP2.2 | R2.2 18.48,46.01 24.7,46.01 27.91,49.21 62.2,49.21 63.44,50.77 JP1.D0
  Top 0.813: 50.2,37.43 50.2,35.53
  Bottom 0.229: JP2.2 50.2,37.53 63.44,50.77 JP1.D0
RX-LED
  Top 0.305: LED3.A R6.1
SCK
  Top 0.229: 24.77,35.53 U3.12 | JP1.SCK 63.72,27.91 63.72,29.05 64.67,30 64.67,30.86 55.78,39.75 27.08,39.75 24.86,37.53 JP2.12
  Top 0.813: JP2.12 24.77,35.53
TX
  Top 0.229: 47.62,35.53 U3.3 | R3.2 14,46.01 15.4,47.12 24.86,47.12 27.72,49.97 27.72,51.34 28.48,52.1 59.72,52.1 60.96,50.86 JP1.D1
  Top 0.813: JP2.3 47.62,35.53
  Bottom 0.229: JP2.3 47.62,37.53 60.96,50.86 JP1.D1
TX-LED
  Top 0.305: LED4.A R7.1
VDD
  Top 0.508: C8.1 11.72,20 11.72,17.72 8.1,14.1 U1.3 8.1,13.81 8.1,10.19 10.48,7.81 G1.TIP
  Bottom 0.508: JP1.VIN 45.72,2.48 45.78,2.48 44.45,1.14 20.35,1.14 14.1,7.71 10.57,7.71 G1.TIP

### Text on the board
tNames: GND | AREF | SCL | SDA | D5 | D4 | D3 | I2C | Y | ZO / X -- | SH21 | TX/D1 | RX/D0 | NextStep | LoRa mini Board | IC2 | Ver0.2 | ADXL345 | LGA-8-5X3 | LoRa mini Module | NS-010230-002 | RX | For Fukuoka City LoRaWAN | TX | POW | D5 | A6 | DIO4 | DIO3 | NSS | A7 | RESET | A5 | A4 | A3 | A2 | A1 | A0 | RESET | +3.3 | +5V | GND | VIN